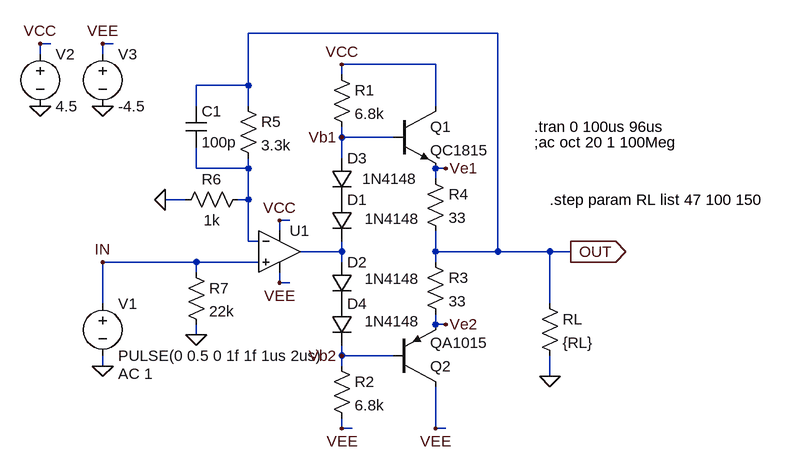
[diagram p0: schematic Push-Pull_Diode_x2_Offset_NF_Step.asc]
Push-Pull_Diode_x2_Offset_NF_Step.asc, the LTspice schematic file:
Version 4
SHEET 1 1052 680
WIRE 384 -160 0 -160
WIRE -304 -144 -320 -144
WIRE -208 -144 -224 -144
WIRE -320 -128 -320 -144
WIRE -224 -128 -224 -144
WIRE 288 -112 144 -112
WIRE 144 -96 144 -112
WIRE 0 -80 0 -160
WIRE 0 -80 -80 -80
WIRE -80 -48 -80 -80
WIRE 0 -48 0 -80
WIRE 288 -48 288 -112
WIRE 144 0 144 -16
WIRE 224 0 144 0
WIRE 144 32 144 0
WIRE -80 48 -80 16
WIRE 0 48 0 32
WIRE 0 48 -80 48
WIRE 304 48 288 48
WIRE 288 64 288 48
WIRE -96 96 -128 96
WIRE 0 96 0 48
WIRE 0 96 -16 96
WIRE 64 128 48 128
WIRE 48 144 48 128
WIRE 0 160 0 96
WIRE 16 160 0 160
WIRE 144 176 144 160
WIRE 144 176 80 176
WIRE 288 176 288 144
WIRE 384 176 384 -160
WIRE 384 176 288 176
WIRE 464 176 384 176
WIRE 496 176 464 176
WIRE -80 192 -224 192
WIRE 16 192 -80 192
WIRE 144 192 144 176
WIRE 288 192 288 176
WIRE -80 208 -80 192
WIRE 48 224 48 208
WIRE 64 224 48 224
WIRE -224 256 -224 192
WIRE 464 256 464 176
WIRE 288 288 288 272
WIRE 304 288 288 288
WIRE -80 304 -80 288
WIRE 144 336 144 320
WIRE 224 336 144 336
WIRE -224 352 -224 336
WIRE 144 352 144 336
WIRE 464 368 464 336
WIRE 144 448 144 432
WIRE 160 448 144 448
WIRE 288 448 288 384
WIRE 304 448 288 448
FLAG 464 368 0
FLAG -224 352 0
FLAG -320 -48 0
FLAG -320 -144 VCC
FLAG 144 -112 VCC
FLAG 496 176 OUT
IOPIN 496 176 Out
FLAG -224 192 IN
FLAG 304 48 Ve1
FLAG 144 0 Vb1
FLAG 144 336 Vb2
FLAG 304 288 Ve2
FLAG -224 -48 0
FLAG -224 -144 VEE
FLAG 144 448 VEE
FLAG 288 448 VEE
FLAG -128 96 0
FLAG 48 224 VEE
FLAG 48 128 VCC
FLAG -80 304 0
SYMBOL res 448 240 R0
SYMATTR InstName RL
SYMATTR Value {RL}
SYMBOL res 128 -112 R0
SYMATTR InstName R1
SYMATTR Value 6.8k
SYMBOL res 128 336 R0
SYMATTR InstName R2
SYMATTR Value 6.8k
SYMBOL voltage -224 240 R0
WINDOW 123 24 124 Left 2
WINDOW 39 24 152 Left 2
SYMATTR Value2 AC 1
SYMATTR InstName V1
SYMATTR Value PULSE(0 0.5 0 1f 1f 1us 2us)
SYMBOL voltage -320 -144 R0
WINDOW 123 0 0 Left 2
WINDOW 39 0 0 Left 2
SYMATTR InstName V2
SYMATTR Value 4.5
SYMBOL diode 128 96 R0
WINDOW 3 51 29 Left 2
SYMATTR Value 1N4148
SYMATTR InstName D1
SYMBOL diode 128 192 R0
WINDOW 3 51 26 Left 2
SYMATTR Value 1N4148
SYMATTR InstName D2
SYMBOL diode 128 32 R0
WINDOW 3 47 32 Left 2
SYMATTR Value 1N4148
SYMATTR InstName D3
SYMBOL diode 128 256 R0
WINDOW 3 51 27 Left 2
SYMATTR Value 1N4148
SYMATTR InstName D4
SYMBOL npn 224 -48 R0
SYMATTR InstName Q1
SYMATTR Value QC1815
SYMBOL pnp 224 384 M180
SYMATTR InstName Q2
SYMATTR Value QA1015
SYMBOL res 272 176 R0
SYMATTR InstName R3
SYMATTR Value 33
SYMBOL res 272 48 R0
SYMATTR InstName R4
SYMATTR Value 33
SYMBOL Opamps\\UniversalOpamp2 48 176 R0
SYMATTR InstName U1
SYMBOL voltage -224 -144 R0
WINDOW 123 0 0 Left 2
WINDOW 39 0 0 Left 2
SYMATTR InstName V3
SYMATTR Value -4.5
SYMBOL res -16 -64 R0
SYMATTR InstName R5
SYMATTR Value 3.3k
SYMBOL res 0 80 R90
WINDOW 0 0 56 VBottom 2
WINDOW 3 32 56 VTop 2
SYMATTR InstName R6
SYMATTR Value 1k
SYMBOL res -96 192 R0
SYMATTR InstName R7
SYMATTR Value 22k
SYMBOL cap -96 -48 R0
SYMATTR InstName C1
SYMATTR Value 100p
TEXT 464 96 Left 2 !.step param RL list 47 100 150
TEXT 440 -16 Left 2 !.tran 0 100us 96us
TEXT 440 8 Left 2 !;ac oct 20 1 100Meg

The netlist it stands for:
* Push-Pull_Diode_x2_Offset_NF_Step.asc
RL OUT 0 {RL}
R1 VCC Vb1 6.8k
R2 Vb2 VEE 6.8k
V1 IN 0 PULSE(0 0.5 0 1f 1f 1us 2us) AC 1
V2 VCC 0 4.5
D1 P001 N002 1N4148
D2 N002 P002 1N4148
D3 Vb1 P001 1N4148
D4 P002 Vb2 1N4148
Q1 VCC Vb1 Ve1 0 QC1815
Q2 VEE Vb2 Ve2 0 QA1015
R3 OUT Ve2 33
R4 Ve1 OUT 33
XU1 IN N001 VCC VEE N002 level.2 Avol=1Meg GBW=10Meg Slew=10Meg ilimit=25m rail=0 Vos=0 phimargin=45 en=0 enk=0 in=0 ink=0 Rin=500Meg  ; pins IN+ IN- V+ V- OUT
V3 VEE 0 -4.5
R5 OUT N001 3.3k
R6 N001 0 1k
R7 IN 0 22k
C1 OUT N001 100p
.model D D
.lib standard.dio
.model NPN NPN
.model PNP PNP
.lib standard.bjt
.step param RL list 47 100 150
.tran 0 100us 96us
;ac oct 20 1 100Meg
.lib UniversalOpamps2.sub
.backanno
.end